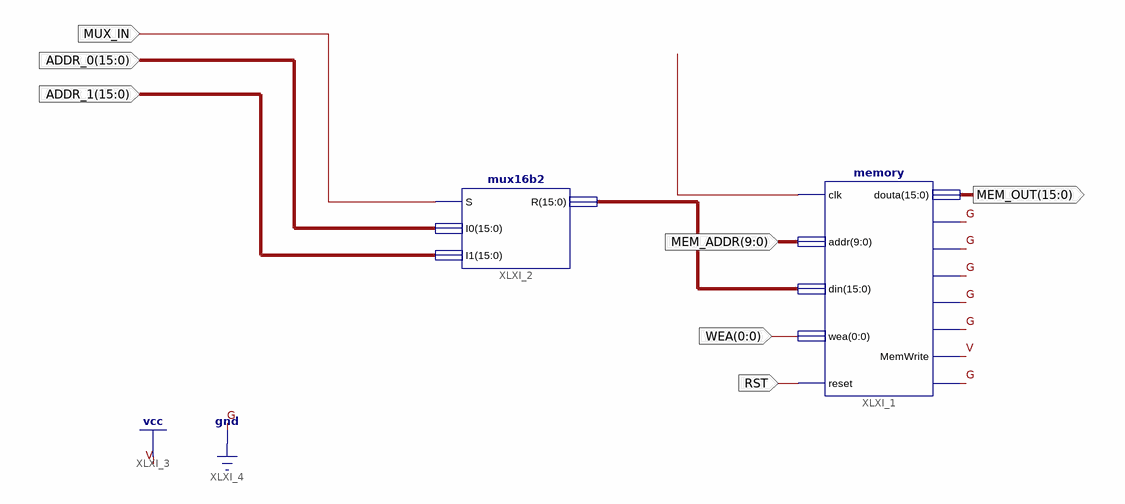
[diagram p0: schematic sheet 1]
// Xilinx ISE schematic Step2.sch (spartan3e) as structural Verilog: 3 symbols, 7 ports
module Step2 (
  input  MUX_IN,
  input  [15:0] ADDR_0,
  input  [15:0] ADDR_1,
  input  [9:0] MEM_ADDR,
  input  [0:0] WEA,
  input  RST,
  output [15:0] MEM_OUT
);

  wire XLXN_28;
  wire [15:0] XLXN_24;

  memory XLXI_1 (
    .clk(XLXN_28), .addr(MEM_ADDR), .din(XLXN_24), .wea(WEA[0]), .reset(RST), .douta(MEM_OUT), .ALUSrc(1'b0),
    .MemtoReg(1'b0), .RegDst(1'b0), .RegWrite(1'b0), .MemRead(1'b0), .MemWrite(1'b1), .Branch(1'b0));
  mux16b2 XLXI_2 (.S(MUX_IN), .I0(ADDR_0), .I1(ADDR_1), .R(XLXN_24));
  Clock XLXI_7 ();
endmodule
